# Altium project Power_Stage.PrjPCB
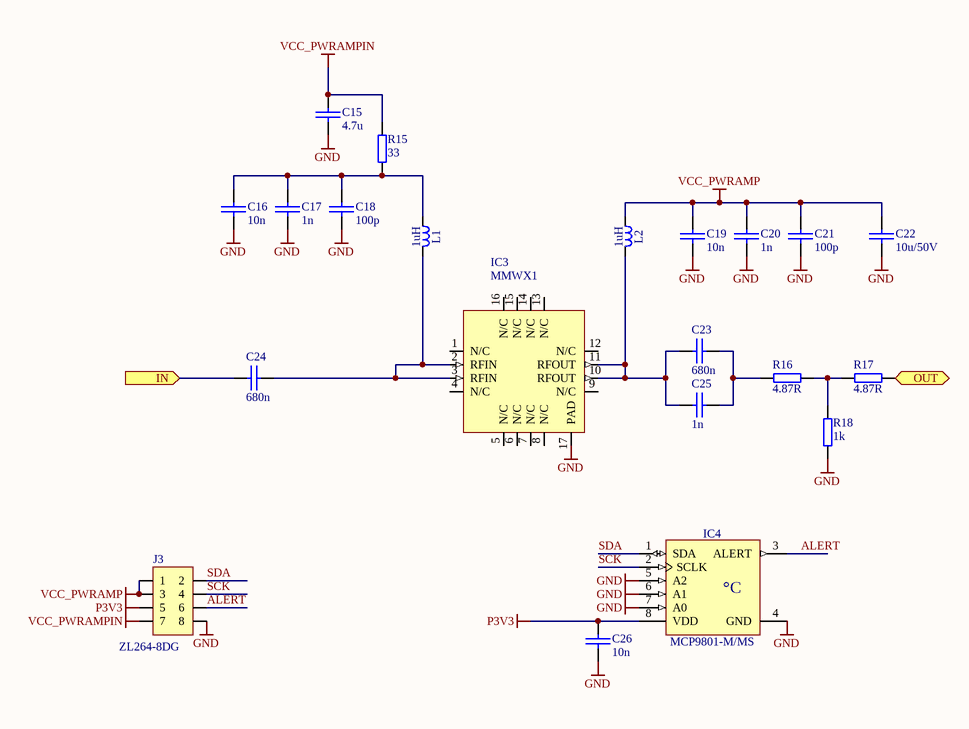
[diagram p0: Power_Stage.SchDoc]
1 sheet, 21 parts. Net scope: flat (ports and power ports of the same name join across sheets).
Board file: PA_Channel_RF2.PcbDoc

## Sheet Power_Stage.SchDoc
size A4

### Parts
C15  4.7u  [0603C]
C16  10n  [0603C]
C17  1n  [0603C]
C18  100p  [0603C]
C19  10n  [0603C]
C20  1n  [0603C]
C21  100p  [0603C]
C22  10u/50V  [0805C]
C23  680n  [0603C]
C24  680n  [0603C]
C25  1n  [0603C]
C26  10n  [0603C]
IC3  MMWX1  [QFN65P400X400X80_HS-17N]
IC4  MCP9801-M/MS  [SOP65P490X110-8N]
J3  ZL264-8DG  [ZL264-8DG]
L1  1uH  [INDP2520X18L]
L2  1uH  [INDP2520X18L]
R15  33  [0603R]
R16  4.87R  [0603R]
R17  4.87R  [0603R]
R18  1k  [0603R]

### Ports
IN (in), OUT (out)

### Nets
GND: C15.2 C16.2 C17.2 C18.2 C19.2 C20.2 C21.2 C22.2 C26.1 IC3.17(PAD) IC4.4(GND) IC4.5(A2) IC4.6(A1) IC4.7(A0) J3.8 R18.1
P3V3: C26.2 IC4.8(VDD) J3.5
VCC_PWRAMP: C19.1 C20.1 C21.1 C22.1 J3.1 J3.3 L2.1
VCC_PWRAMPIN: C15.1 J3.7 R15.2
ALERT: IC4.3(ALERT) J3.6
SCK: IC4.2(SCLK) J3.4
SDA: IC4.1(SDA) J3.2
NetC16_1: C16.1 C17.1 C18.1 L1.1 R15.1
NetC23_1: C23.1 C25.1 IC3.10(RFOUT) IC3.11(RFOUT) L2.2
NetC23_2: C23.2 C25.2 R16.1
NetC24_1: C24.1 ; port IN
NetC24_2: C24.2 IC3.2(RFIN) IC3.3(RFIN) L1.2
NetR16_2: R16.2 R17.1 R18.2
NetR17_2: R17.2 ; port OUT

Not connected (* = marked no-connect by the designer): IC3 1(N/C) 4(N/C) 5(N/C) 6(N/C) 7(N/C) 8(N/C) 9(N/C) 12(N/C) 13(N/C) 14(N/C) 15(N/C) 16(N/C)

### Notes on the sheet
- (in symbol MCP9801-M/MS) °C

### Library data of the parts
C15 = CAP_SMD_0603: Capacitor SMD; Part: GRM21BR71C475KE51L; Supplier 1: Digi-Key; Supplier Part Number 1: 490-1524-2-ND
C16 C19 = CAP_SMD_0603: Capacitor SMD; Part: GRM1885C1H103JA01D; Supplier 1: Digi-Key; Supplier Part Number 1: 490-1524-2-ND
C17 C20 C25 = CAP_SMD_0603: Capacitor SMD; Part: GRM1885C1H102JA01D; Supplier 1: Digi-Key; Supplier Part Number 1: 490-1524-2-ND
C18 C21 = CAP_SMD_0603: Capacitor SMD; Part: C1608NP01H101J080AA; Supplier 1: Digi-Key; Supplier Part Number 1: 490-1524-2-ND
C22 = CAP_SMD_0805: Capacitor SMD; Part: GRM32ER71H106KA12L; Supplier 1: Farnell; Supplier Part Number 1: 1833812
C23 C24 = CAP_SMD_0603: Capacitor SMD; Part: GRM1555C1H681GA01; Supplier 1: Digi-Key; Supplier Part Number 1: 490-1524-2-ND
C26 = CAP_SMD_0603: Capacitor SMD; Supplier 1: Digi-Key; Supplier Part Number 1: 490-1524-2-ND
IC3 = RF_NPA1003QA
IC4 = MCP9801-M/MS: 2-Wire High-Accuracy Temperature Sensor; Manufacturer: MICROCHIP TECHNOLOGIY; PressFit: No; Bonding: No; Part Number: MCP9801-M/MS; Component Kind: Standard; Component Type: Standard; Device: MCP9801-M/MS; PackageDescription: SOP, 0.65mm pitch; 8 pin, 3.00mm W X 3.00mm L X 1.10mm H body, IPC Medium Density; Part Description: 2-Wire High-Accuracy Temperature Sensor; Manufacturer Part Number: MCP9801-M/MS; Pin Count: 8; Case: MSOP8; Mounted: Yes; Socket: No; SMD: Yes; Sense: No; ComponentHeight: 1.1mm; HelpURL: \\cern.ch\dfs\Applications\Altium\Datasheets\MCP9801-M-MS.pdf; Author: CERN DEM JLC; CreateDate: 18.11.2009; LatestRevisionDate: 18.11.2009
J3 = CON_2X4 2.54 SMT FEM: 2.54mm pitch connector
L1 = L_1008_100u: Part: LQW2UAS1R0J00L; Author: GK
L2 = L_1008_100u: 100uH, 60mA, 21R; Part: 1008LS-102XJLB; Author: GK
R15 = RES_0603: SMD Resistor; Part: CR0603-FX-33R0ELF; Supplier 1: Newark; Supplier Part Number 1: 39K0073
R16 R17 = RES_0603: SMD Resistor; Part: CPF0603B4R87E1; Supplier 1: Newark; Supplier Part Number 1: 39K0073
R18 = RES_0603: SMD Resistor; Part: RP73PF1J1K0BTDF; Supplier 1: Newark; Supplier Part Number 1: 39K0073